# EAGLE design 8bit-v0_1 (EAGLE 7.2.0)
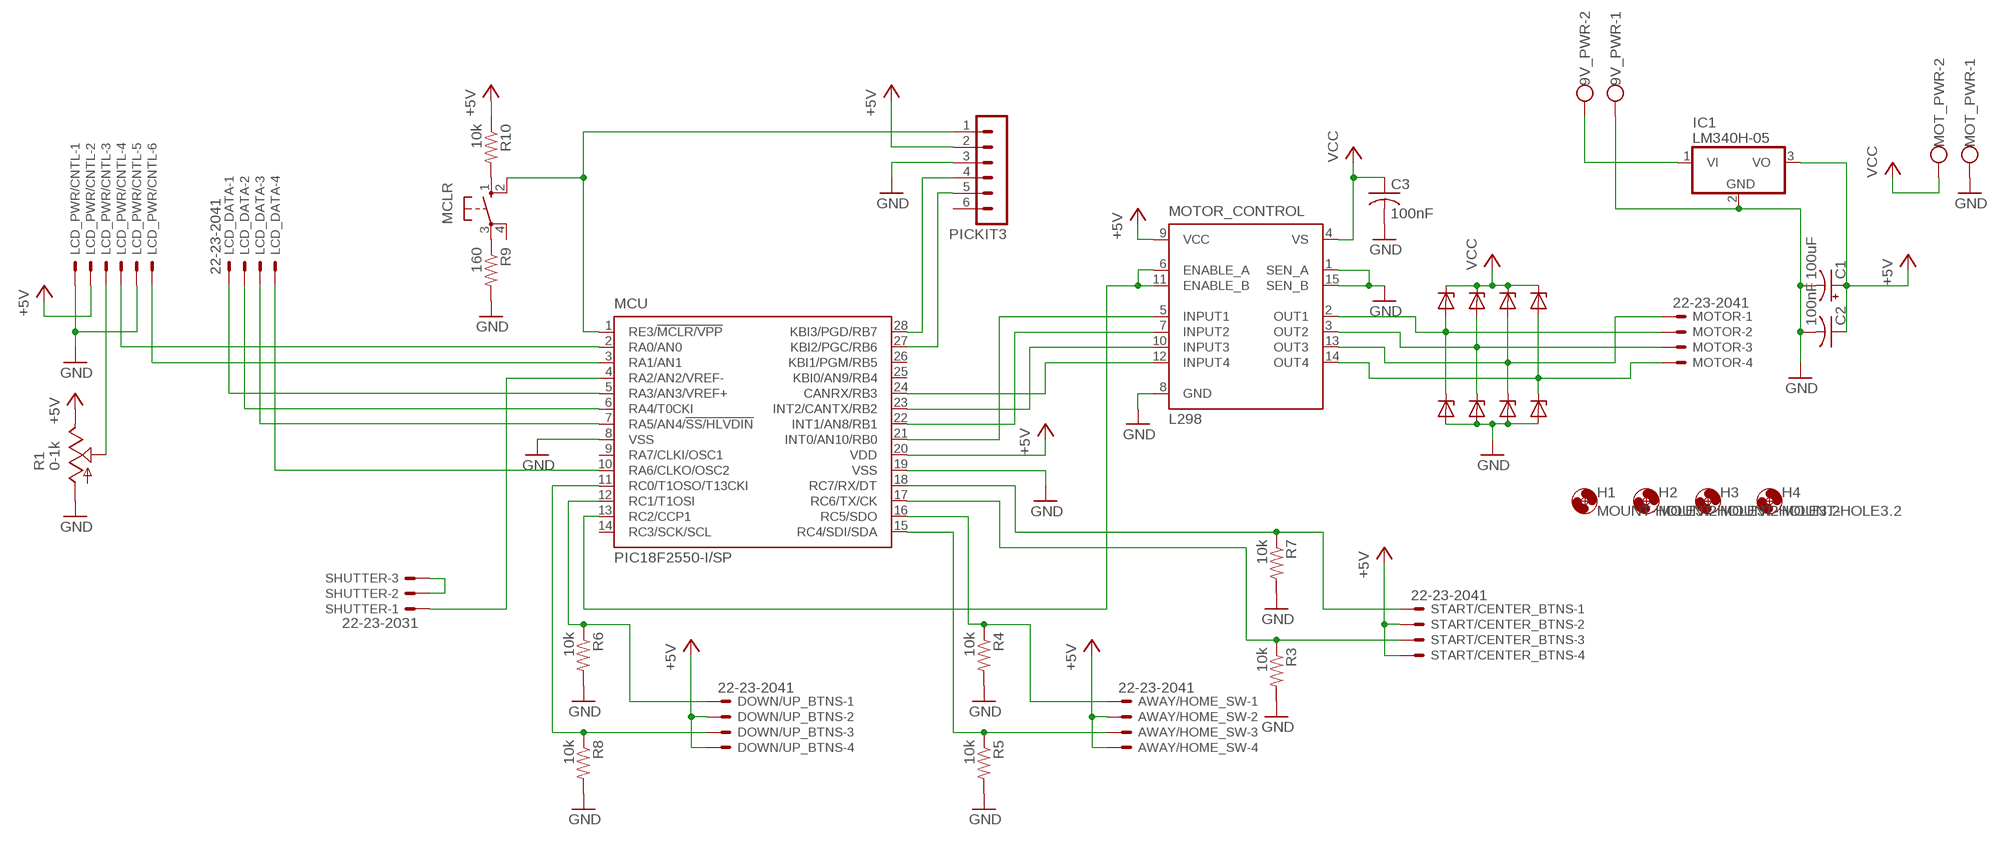
[diagram p0: schematic, sheet 1]

## Parts
9V_PWR  W237-102  [W237-102]
AWAY/HOME_SW  22-23-2041  [22-23-2041]
C1  100uF  CPOL-USE2.5-7  [E2,5-7]
C2  100nF  C-US025-025X050  [C025-025X050]
C3  100nF  C-US025-025X050  [C025-025X050]
D1  BZX90  [DO34Z7]
D2  BZX90  [DO34Z7]
D3  BZX90  [DO34Z7]
D4  BZX90  [DO34Z7]
D5  BZX90  [DO34Z7]
D6  BZX90  [DO34Z7]
D7  BZX90  [DO34Z7]
D8  BZX90  [DO34Z7]
DOWN/UP_BTNS  22-23-2041  [22-23-2041]
H1  MOUNT-HOLE3.2  [3,2]
H2  MOUNT-HOLE3.2  [3,2]
H3  MOUNT-HOLE3.2  [3,2]
H4  MOUNT-HOLE3.2  [3,2]
IC1  LM340H-05  [TO220H]
LCD_DATA  22-23-2041  [22-23-2041]
LCD_PWR/CNTL  22-23-2061  [22-23-2061]
MCLR  10-XX  [B3F-10XX]
MCU  PIC18F2580-I/SP  [DIL28-3]
MOT_PWR  W237-102  [W237-102]
MOTOR  22-23-2041  [22-23-2041]
MOTOR_CONTROL  L298  [MULTIWATT-15]
PICKIT3  MA06-1  [MA06-1]
R1  0-1k  TRIM_US-B25P  [B25P]
R3  10k  R-US_0207/10  [0207/10]
R4  10k  R-US_0207/10  [0207/10]
R5  10k  R-US_0207/10  [0207/10]
R6  10k  R-US_0207/10  [0207/10]
R7  10k  R-US_0207/10  [0207/10]
R8  10k  R-US_0207/10  [0207/10]
R9  160  R-US_0207/10  [0207/10]
R10  10k  R-US_0207/10  [0207/10]
SHUTTER  22-23-2031  [22-23-2031]
START/CENTER_BTNS  22-23-2041  [22-23-2041]

## Nets
+5V: AWAY/HOME_SW.2 AWAY/HOME_SW.4 C1.+ C2.1 DOWN/UP_BTNS.2 DOWN/UP_BTNS.4 IC1.3(VO) LCD_PWR/CNTL.2 MCU.20(VDD) MOTOR_CONTROL.9(VCC) PICKIT3.2 R1.E R10.1 START/CENTER_BTNS.2 START/CENTER_BTNS.4
GND: 9V_PWR.1 C1.- C2.2 C3.2 D5.A D6.A D7.A D8.A IC1.2(GND) LCD_PWR/CNTL.1 LCD_PWR/CNTL.5 MCU.8(VSS) MCU.19(VSS) MOT_PWR.1 MOTOR_CONTROL.8(GND) PICKIT3.3 R1.A R3.2 R4.2 R5.2 R6.2 R7.2 R8.2 R9.2
N$1: MCLR.2(S1) MCU.1(RE3/!MCLR/VPP) PICKIT3.1
N$2: MCU.27(KBI2/PGC/RB6) PICKIT3.5
N$3: MCU.28(KBI3/PGD/RB7) PICKIT3.4
N$4: LCD_PWR/CNTL.3 R1.S
N$5: MOTOR_CONTROL.1(SEN_A) MOTOR_CONTROL.15(SEN_B) ; supply symbol labelled GND
N$6: MCU.24(CANRX/RB3) MOTOR_CONTROL.12(INPUT4)
N$7: MCU.23(INT2/CANTX/RB2) MOTOR_CONTROL.10(INPUT3)
N$8: MCU.22(INT1/AN8/RB1) MOTOR_CONTROL.7(INPUT2)
N$9: LCD_PWR/CNTL.4 MCU.2(RA0/AN0)
N$10: LCD_PWR/CNTL.6 MCU.3(RA1/AN1)
N$11: LCD_DATA.1 MCU.5(RA3/AN3/VREF+)
N$12: LCD_DATA.3 MCU.7(RA5/AN4/!SS/HLVDIN)
N$13: LCD_DATA.4 MCU.10(RA6/CLKO/OSC2)
N$14: MCU.21(INT0/AN10/RB0) MOTOR_CONTROL.5(INPUT1)
N$15: AWAY/HOME_SW.1 MCU.16(RC5/SDO) R4.1
N$16: D2.A D6.C MOTOR.3 MOTOR_CONTROL.3(OUT2)
N$17: D3.A D7.C MOTOR.1 MOTOR_CONTROL.13(OUT3)
N$18: D4.A D8.C MOTOR.4 MOTOR_CONTROL.14(OUT4)
N$19: AWAY/HOME_SW.3 MCU.15(RC4/SDI/SDA) R5.1
N$20: LCD_DATA.2 MCU.6(RA4/T0CKI)
N$21: MCU.17(RC6/TX/CK) R3.1 START/CENTER_BTNS.3
N$23: DOWN/UP_BTNS.1 MCU.12(RC1/T1OSI) R6.1
N$24: MCU.18(RC7/RX/DT) R7.1 START/CENTER_BTNS.1
N$25: DOWN/UP_BTNS.3 MCU.11(RC0/T1OSO/T13CKI) R8.1
N$28: D1.A D5.C MOTOR.2 MOTOR_CONTROL.2(OUT1)
N$30: MCU.13(RC2/CCP1) MOTOR_CONTROL.6(ENABLE_A) MOTOR_CONTROL.11(ENABLE_B)
N$34: MCU.4(RA2/AN2/VREF-) SHUTTER.1
N$35: MCLR.1(S) R10.2
N$36: SHUTTER.2 SHUTTER.3
N$38: MCLR.3(P) R9.1
N$40: 9V_PWR.2 IC1.1(VI)
VCC: C3.1 D1.C D2.C D3.C D4.C MOT_PWR.2 MOTOR_CONTROL.4(VS)
Unconnected: MCLR.4(P1) MCU.9(RA7/CLKI/OSC1) MCU.14(RC3/SCK/SCL) MCU.25(KBI0/AN9/RB4) MCU.26(KBI1/PGM/RB5) PICKIT3.6

## Library data of the parts
9V_PWR MOT_PWR = con-wago-500:W237-102: WAGO SCREW CLAMP; MPN: 237-102; OC_FARNELL: unknown; OC_NEWARK: 70K9898
AWAY/HOME_SW DOWN/UP_BTNS LCD_DATA MOTOR START/CENTER_BTNS = con-molex:22-23-2041: .100" (2.54mm) Center Header - 4 Pin; MF: MOLEX; MPN: 22-23-2041; OC_FARNELL: 1462920; OC_NEWARK: 38C0355
C1 = rcl:CPOL-US: POLARIZED CAPACITOR, American symbol
C2 C3 = rcl:C-US: CAPACITOR, American symbol
D1-D8 = diode:BZX90: Z DIODE
H1-H4 = holes:MOUNT-HOLE: MOUNTING HOLE with drill center marker
IC1 = linear:LM340?-*: Positive VOLTAGE REGULATOR Source: http://cache.national.com/ds/LM/LM340.pdf
LCD_PWR/CNTL = con-molex:22-23-2061: .100" (2.54mm) Center Header - 6 Pin; MF: MOLEX; MPN: 22-23-2061; OC_FARNELL: 1462922; OC_NEWARK: 27C1933
MCLR = switch-omron:10-XX: OMRON SWITCH; MPN: B3F-1000; OC_FARNELL: 176432; OC_NEWARK: 36M3542
MCU = microchip:PIC18F2*80: 28-Pin Enhanced Flash Microcontrollers with ECAN(TM) Technology 10-Bit A/D and nanoWatt Technology Source: http://www.microchip.com .. 39637a.pdf; MF: MICROCHIP; MPN: PIC18F2550-I/SP; OC_FARNELL: 9321276; OC_NEWARK: 71J7244
MOTOR_CONTROL = st-microelectronics:L298: DUAL FULL-BRIDGE DRIVER; MPN: L298N; OC_FARNELL: 1589425; OC_NEWARK: 32M1527
PICKIT3 = con-lstb:MA06-1: PIN HEADER; OC_FARNELL: unknown; OC_NEWARK: unknown
R1 = pot:TRIM_US-: POTENTIOMETER
R3-R10 = rcl:R-US_: RESISTOR, American symbol
SHUTTER = con-molex:22-23-2031: .100" (2.54mm) Center Header - 3 Pin; MF: MOLEX; MPN: 22-23-2031; OC_FARNELL: 1462950; OC_NEWARK: 30C0862

## Board
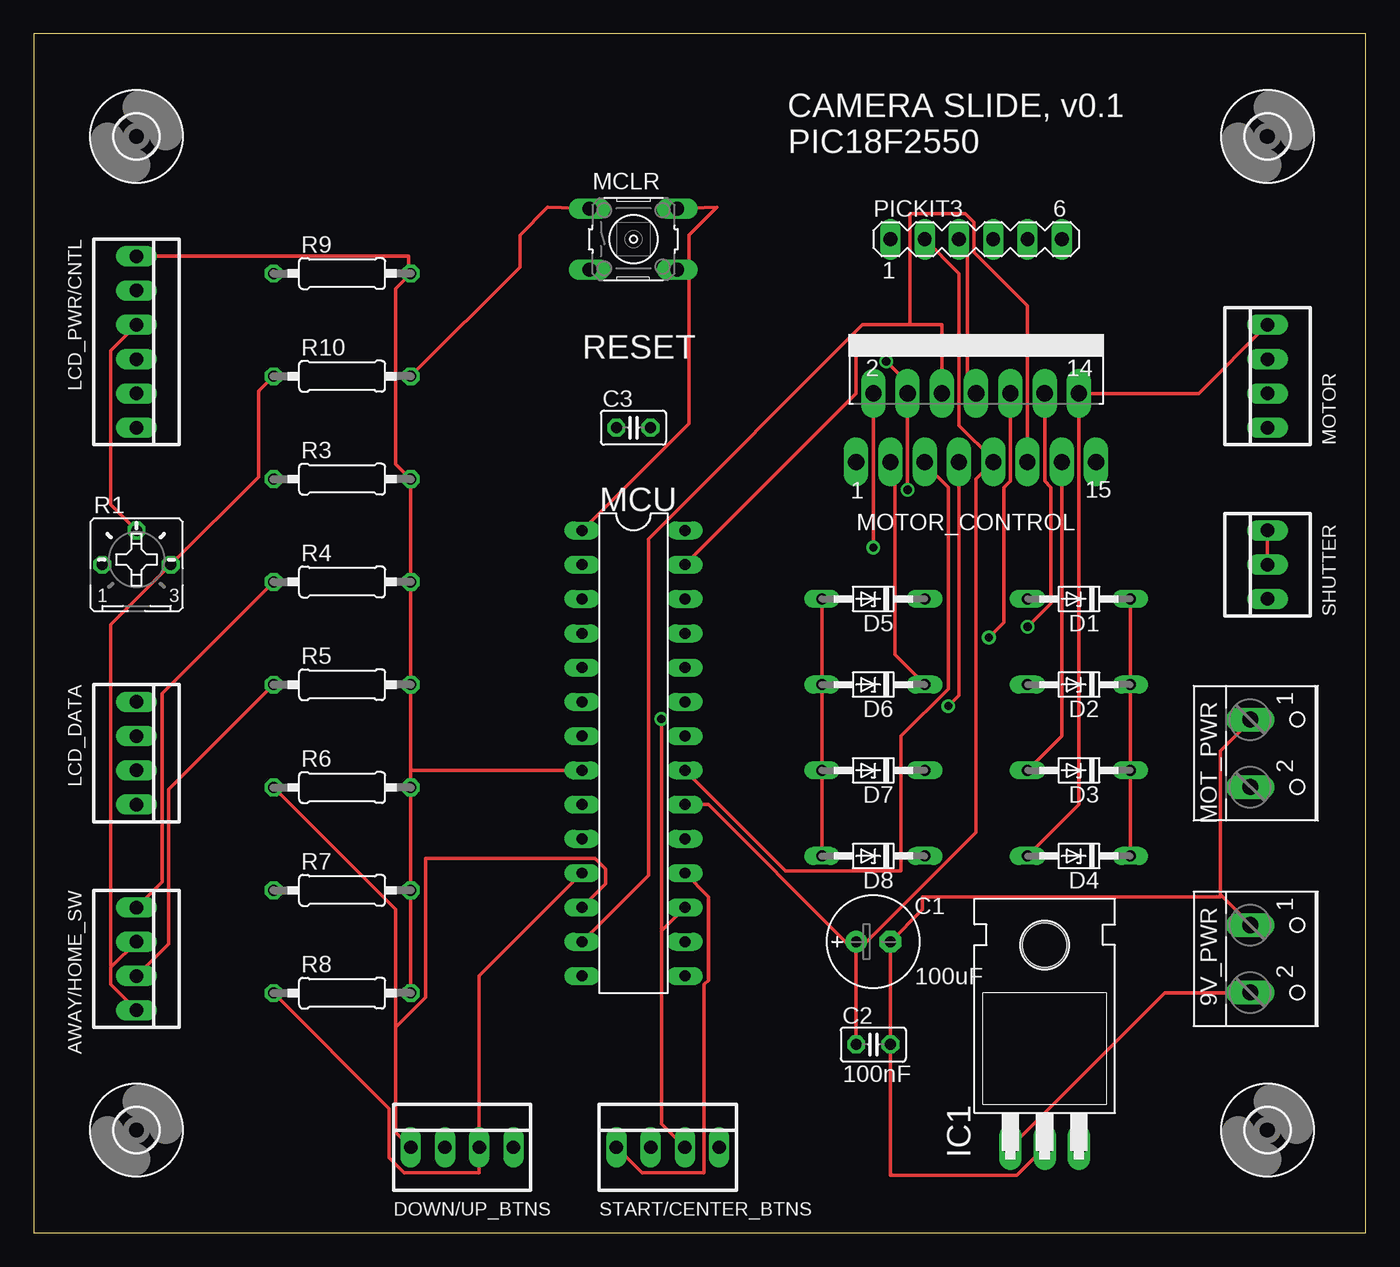
[diagram p1: board, top side]
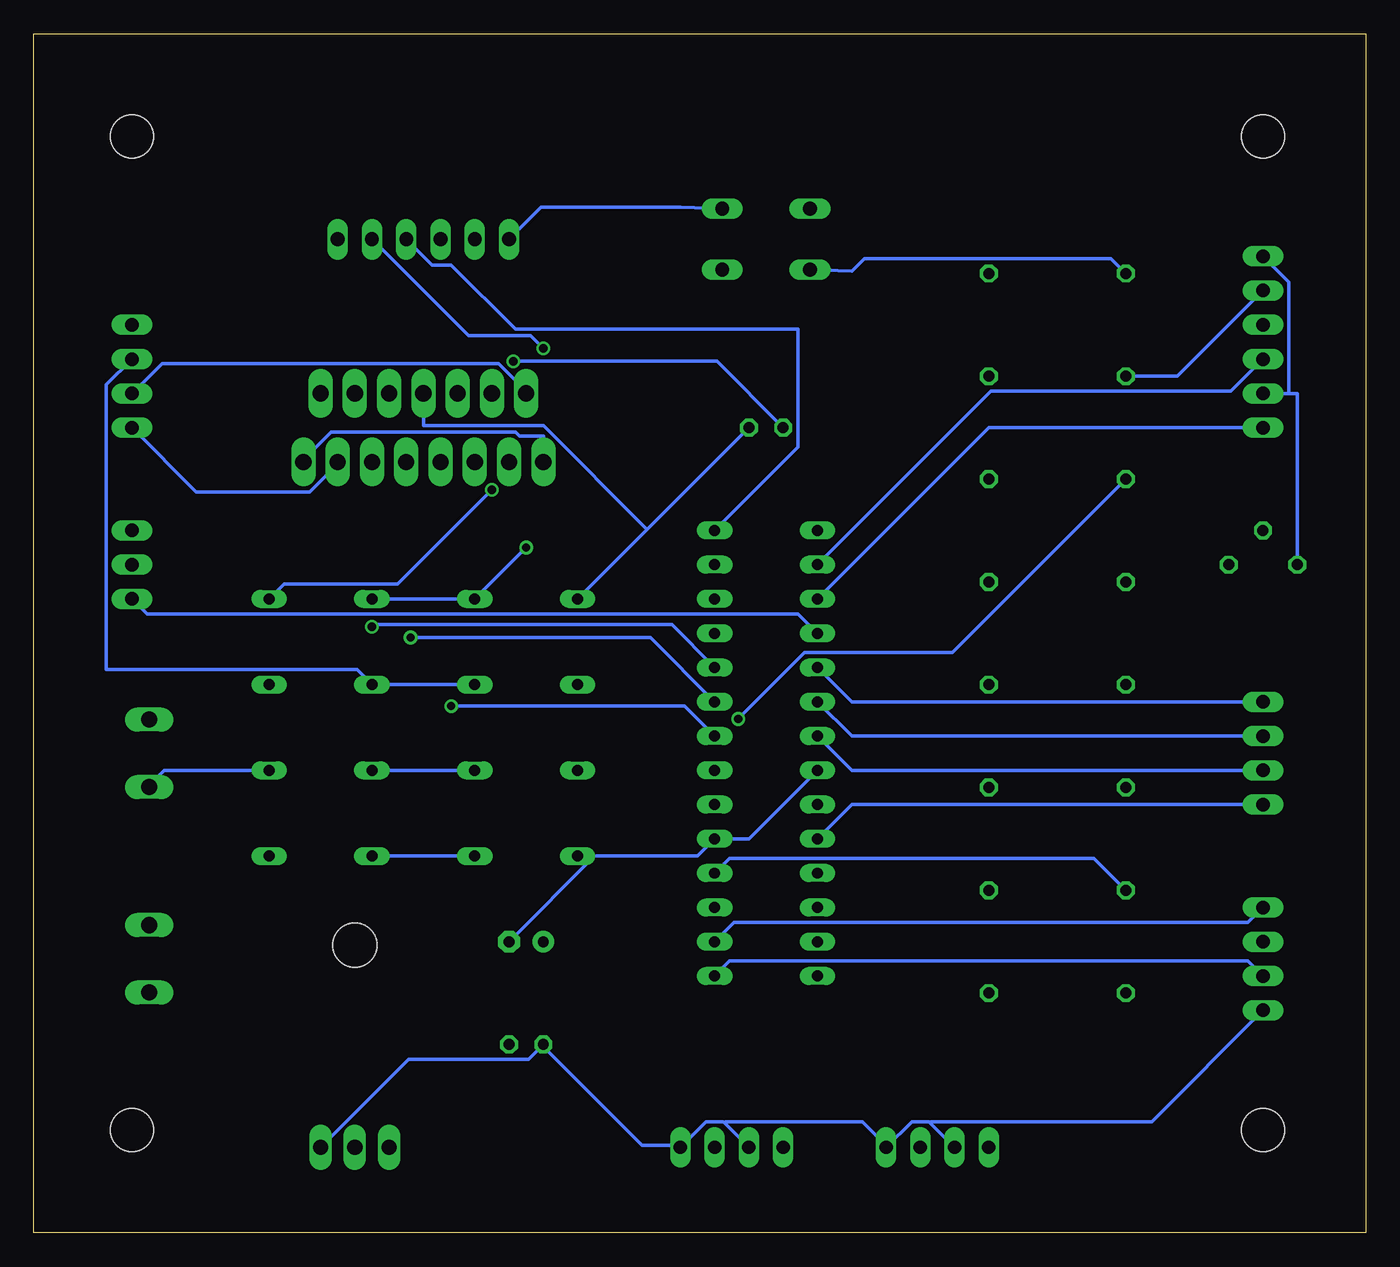
[diagram p2: board, bottom side, seen from below]

Size 98.73 x 88.89 mm. Coordinates in mm from the lower left corner, seen from the top.
Outline: 0,0 98.73,0 98.73,88.89 0,88.89 0,0
Copper layers (1*16): Top 0.035mm / dielectric 1.5mm / Bottom 0.035mm
Design rules "default": minimum track width 10mil, minimum drill 24mil, track to track 8mil, track to pad 8mil, pad to pad 8mil, via to via 8mil, smd to smd 8mil, copper to edge 40mil, drill to drill 8mil, minimum pad ring 10mil, minimum via ring 8mil, stop-mask expansion 4mil, vias tented up to drill 0mil, thermal gap 10mil

### Footprints (pad centres in the part's own frame; a part is rotated, then mirrored left to right if it is on the bottom)
W237-102 = drill 1.194 long: 1 -2.5,-1.27; 2 2.5,-1.27
22-23-2041 = drill 1 long: 1 -3.81,0; 2 -1.27,0; 3 1.27,0; 4 3.81,0
E2,5-7 = drill 0.813 pad 1.6: + -1.27,0 | drill 0.813 pad 1.6 octagon: - 1.27,0
C025-025X050 = drill 0.813 octagon: 1 -1.27,0; 2 1.27,0
DO34Z7 = drill 0.813 long: A 3.81,0; C -3.81,0
3,2 = hole 3.2: 0,0
TO220H = drill 1.118 long: 1 -2.54,-10.16; 2 0,-10.16; 3 2.54,-10.16 | hole 3.302: 0,4.826
22-23-2061 = drill 1 long: 1 -6.35,0; 2 -3.81,0; 3 -1.27,0; 4 1.27,0; 5 3.81,0; 6 6.35,0
B3F-10XX = drill 1.016 long: 1 -3.251,2.261; 2 3.251,2.261; 3 -3.251,-2.261; 4 3.251,-2.261
DIL28-3 = drill 0.813 long: 1 -16.51,-3.81; 2 -13.97,-3.81; 3 -11.43,-3.81; 4 -8.89,-3.81; 5 -6.35,-3.81; 6 -3.81,-3.81; 7 -1.27,-3.81; 8 1.27,-3.81; 9 3.81,-3.81; 10 6.35,-3.81; 11 8.89,-3.81; 12 11.43,-3.81; 13 13.97,-3.81; 14 16.51,-3.81; 15 16.51,3.81; 16 13.97,3.81; 17 11.43,3.81; 18 8.89,3.81; 19 6.35,3.81; 20 3.81,3.81; 21 1.27,3.81; 22 -1.27,3.81; 23 -3.81,3.81; 24 -6.35,3.81; 25 -8.89,3.81; 26 -11.43,3.81; 27 -13.97,3.81; 28 -16.51,3.81
MULTIWATT-15 = drill 1.2 long: 1 -8.89,-7.62; 2 -7.62,-2.54; 3 -6.35,-7.62; 4 -5.08,-2.54; 5 -3.81,-7.62; 6 -2.54,-2.54; 7 -1.27,-7.62; 8 0,-2.54; 9 1.27,-7.62; 10 2.54,-2.54; 11 3.81,-7.62; 12 5.08,-2.54; 13 6.35,-7.62; 14 7.62,-2.54; 15 8.89,-7.62
MA06-1 = drill 1.016 long: 1 -6.35,0; 2 -3.81,0; 3 -1.27,0; 4 1.27,0; 5 3.81,0; 6 6.35,0
B25P = drill 0.813 octagon: A -2.54,0; E 2.54,0; S 0,2.54
0207/10 = drill 0.813 octagon: 1 -5.08,0; 2 5.08,0
22-23-2031 = drill 1 long: 1 -2.54,0; 2 0,0; 3 2.54,0

### Placement (x,y rotation side)
9V_PWR  91.44,20.32 270 top
AWAY/HOME_SW  7.62,20.32 270 top
C1  62.23,21.59 0 top
C2  62.23,13.97 0 top
C3  44.45,59.69 0 top
D1  77.47,46.99 180 top
D2  77.47,40.64 180 top
D3  77.47,34.29 180 top
D4  77.47,27.94 180 top
D5  62.23,46.99 180 top
D6  62.23,40.64 180 top
D7  62.23,34.29 180 top
D8  62.23,27.94 180 top
DOWN/UP_BTNS  31.75,6.35 0 top
H1  7.62,7.62 0 top
H2  91.44,7.62 0 top
H3  91.44,81.28 0 top
H4  7.62,81.28 0 top
IC1  74.93,16.51 0 top
LCD_DATA  7.62,35.56 270 top
LCD_PWR/CNTL  7.62,66.04 270 top
MCLR  44.45,73.66 0 top
MCU  44.45,35.56 270 top
MOT_PWR  91.44,35.56 270 top
MOTOR  91.44,63.5 90 top
MOTOR_CONTROL  69.85,64.77 0 top
PICKIT3  69.85,73.66 0 top
R1  7.62,49.53 0 top
R3  22.86,55.88 0 top
R4  22.86,48.26 0 top
R5  22.86,40.64 0 top
R6  22.86,33.02 0 top
R7  22.86,25.4 0 top
R8  22.86,17.78 0 top
R9  22.86,71.12 0 top
R10  22.86,63.5 0 top
SHUTTER  91.44,49.53 90 top
START/CENTER_BTNS  46.99,6.35 0 top

### Tracks (layer width: path | path; a pad name or v marks a point on that pad's centre or on a via)
+5V
  Top 0.254: PICKIT3.2 68.58,71.12 68.58,59.85 71.12,57.31 MOTOR_CONTROL.9 69.85,55.88 69.85,29.69 60.96,20.8 | MCU.20 50.01,31.75 60.17,21.59 C1.+ 60.96,20.8 | 60.96,20.8 C2.1 | R10.1 16.67,62.39 16.67,56.04 R1.E 5.71,45.09 5.71,19.84 5.79,19.76 | AWAY/HOME_SW.4 5.71,18.41 5.71,19.68 5.79,19.76 | AWAY/HOME_SW.2 5.79,19.76
  Bottom 0.254: IC1.3 70.96,12.86 62.07,12.86 C2.1 60.96,13.81 53.66,6.51 50.8,6.51 START/CENTER_BTNS.4 48.9,8.26 47.62,8.26 47.55,8.18 | LCD_PWR/CNTL.2 13.97,63.5 R10.1 | 32.31,8.18 32.38,8.26 33.66,8.26 DOWN/UP_BTNS.4 35.56,6.51 37.31,8.26 47.47,8.26 47.55,8.18 | 32.31,8.18 DOWN/UP_BTNS.2 | 47.55,8.18 START/CENTER_BTNS.2 | AWAY/HOME_SW.4 15.88,8.26 32.23,8.26 32.31,8.18
GND
  Top 0.254: R8.2 R7.2 R6.2 27.94,34.29 | 27.94,34.29 R5.2 R4.2 R3.2 26.83,56.99 26.83,70.01 R9.2 27.78,71.12 27.78,72.39 LCD_PWR/CNTL.1 | 88.03,25 87.95,25.08 87.95,35.72 90.17,37.94 MOT_PWR.1 | 88.03,25 90.17,22.86 9V_PWR.1 | IC1.2 72.87,4.29 63.5,4.29 C2.2 C1.- 65.88,23.97 65.88,24.92 87.95,24.92 88.03,25 | PICKIT3.3 69.22,73.03 69.22,62.87 MOTOR_CONTROL.8 | D8.A D7.A D6.A D5.A | MCU.8 27.94,34.29
  Bottom 0.254: R1.A 5.08,62.23 5.71,62.23 | LCD_PWR/CNTL.5 5.71,62.23 | LCD_PWR/CNTL.1 5.71,70.48 5.71,62.23 | MCU.8 45.72,29.21 MCU.19 49.53,27.94 57.15,27.94 | D5.A 53.26,52.15 | 53.26,52.15 C3.2 | MOTOR_CONTROL.8 69.85,59.85 60.96,59.85 53.26,52.15 | 57.15,27.94 C1.- | 57.15,27.94 D8.A
N$1
  Top 0.254: MCU.1 48.58,60.01 48.58,73.98 50.64,76.04 MCLR.2
  Bottom 0.254: PICKIT3.1 61.12,76.04 50.8,76.04 MCLR.2
N$2  (via drill 0.61)
  Top 0.254: MCU.27 60.96,62.23 v60.96,65.56
  Bottom 0.254: v60.96,65.56 61.91,66.52 66.52,66.52 PICKIT3.5
N$3
  Bottom 0.254: MCU.28 42.07,58.26 42.07,66.99 63.02,66.99 67.79,71.75 69.22,71.75 PICKIT3.4
N$4
  Top 0.254: R1.S 5.71,53.98 5.71,65.41 LCD_PWR/CNTL.3
N$5
  Bottom 0.254: MOTOR_CONTROL.1 60.96,59.05 62.71,59.05 63.02,59.37 76.68,59.37 78.74,57.31 MOTOR_CONTROL.15
N$6  (via drill 0.61)
  Top 0.254: v73.66,44.93 75.41,46.67 75.41,55.24 74.93,55.72 MOTOR_CONTROL.12
  Bottom 0.254: MCU.24 51.44,45.09 73.5,45.09 v73.66,44.93
N$7  (via drill 0.61)
  Top 0.254: v70.8,44.13 71.91,45.24 71.91,55.24 72.39,55.72 MOTOR_CONTROL.10
  Bottom 0.254: MCU.23 53.02,44.13 v70.8,44.13
N$8  (via drill 0.61)
  Top 0.254: v67.79,39.05 68.58,39.85 MOTOR_CONTROL.7
  Bottom 0.254: MCU.22 50.48,39.05 v67.79,39.05
N$9
  Bottom 0.254: MCU.2 27.78,62.39 10,62.39 LCD_PWR/CNTL.4
N$10
  Bottom 0.254: MCU.3 27.94,59.69 LCD_PWR/CNTL.6
N$11
  Bottom 0.254: MCU.5 38.1,39.37 LCD_DATA.1
N$12
  Bottom 0.254: MCU.7 38.1,34.29 LCD_DATA.3
N$13
  Bottom 0.254: MCU.10 38.1,31.75 LCD_DATA.4
N$14
  Top 0.254: MCU.21 55.72,26.83 64.29,26.83 64.29,36.83 67.79,40.32 67.79,55.24 66.04,56.99 MOTOR_CONTROL.5
N$15
  Top 0.254: R4.1 9.53,40.01 9.53,26.04 AWAY/HOME_SW.1
  Bottom 0.254: MCU.16 46.83,23.02 8.73,23.02 AWAY/HOME_SW.1
N$16
  Top 0.254: MOTOR_CONTROL.3 63.82,56.83 63.82,42.86 D6.C
  Bottom 0.254: D6.C D2.A 74.77,41.75 93.34,41.75 93.34,62.87 MOTOR.3
N$17
  Top 0.254: D3.A 76.2,36.83 MOTOR_CONTROL.13
  Bottom 0.254: D3.A D7.C | MOTOR.1 86.68,54.93 78.26,54.93 76.2,56.99 MOTOR_CONTROL.13
N$18
  Top 0.254: MOTOR.4 86.36,62.23 MOTOR_CONTROL.14 77.47,31.75 D4.A
  Bottom 0.254: D4.A D8.C
N$19
  Top 0.254: R5.1 10,32.86 10,21.43 AWAY/HOME_SW.3
  Bottom 0.254: MCU.15 47.15,20.16 8.73,20.16 AWAY/HOME_SW.3
N$20
  Bottom 0.254: MCU.6 38.1,36.83 LCD_DATA.2
N$21  (via drill 0.61)
  Top 0.254: 46.59,22.46 46.51,22.38 46.51,8.1 START/CENTER_BTNS.3 | 46.59,22.46 MCU.17 | v46.51,38.1 46.51,22.54 46.59,22.46
  Bottom 0.254: R3.1 30.64,43.02 41.59,43.02 v46.51,38.1
N$23
  Top 0.254: R6.1 26.83,23.97 26.83,15.24 | 26.83,15.24 26.83,7.46 DOWN/UP_BTNS.1 | MCU.12 42.39,25.88 42.39,26.99 41.59,27.78 29.05,27.78 29.05,17.46 26.83,15.24
N$24
  Top 0.254: START/CENTER_BTNS.1 45.09,4.45 49.69,4.45 49.69,18.41 50.01,18.73 50.01,24.92 MCU.18
  Bottom 0.254: R7.1 20.16,27.78 47.15,27.78 MCU.18
N$25
  Top 0.254: R8.1 26.35,9.21 26.35,5.56 27.46,4.45 33.02,4.45 DOWN/UP_BTNS.3 33.02,19.05 MCU.11
N$28  (via drill 0.61)
  Top 0.254: MOTOR_CONTROL.2 v62.23,50.8
  Bottom 0.254: D1.A D5.C v62.23,50.8 | MOTOR.2 89.22,64.45 64.29,64.45 62.23,62.39 MOTOR_CONTROL.2
N$30
  Top 0.254: MCU.13 45.56,26.51 45.56,51.44 61.44,67.31 64.93,67.31 | 64.93,67.31 67.31,67.31 MOTOR_CONTROL.6 | MOTOR_CONTROL.11 73.66,68.74 69.69,72.71 69.69,74.93 69.06,75.56 64.93,75.56 64.93,67.31
N$34
  Bottom 0.254: MCU.4 42.07,45.88 90.33,45.88 SHUTTER.1
N$35
  Top 0.254: R10.2 36.04,71.6 36.04,73.98 38.1,76.04 MCLR.1
N$36
  Top 0.254: SHUTTER.3 SHUTTER.2
N$38
  Bottom 0.254: R9.1 18.89,72.23 37.15,72.23 38.1,71.28 MCLR.3
N$40
  Top 0.254: IC1.1 83.82,17.78 90.17,17.78 9V_PWR.2
VCC  (via drill 0.61)
  Top 0.254: v63.18,64.61 64.77,63.02 MOTOR_CONTROL.4 v64.77,55.09 | D1.C D2.C D3.C D4.C
  Bottom 0.254: C3.1 48.1,64.61 v63.18,64.61 | D3.C 89.06,34.29 90.17,33.18 MOT_PWR.2 | v64.77,55.09 71.75,48.1 80.17,48.1 D1.C

### Text on the board
tPlace: CAMERA SLIDE, v0.1 / PIC18F2550 | RESET